# Altium schematic sheet InputOutput.SchDoc
size 279 x 177 mm; SheetNumber: 5; SheetTotal: 5
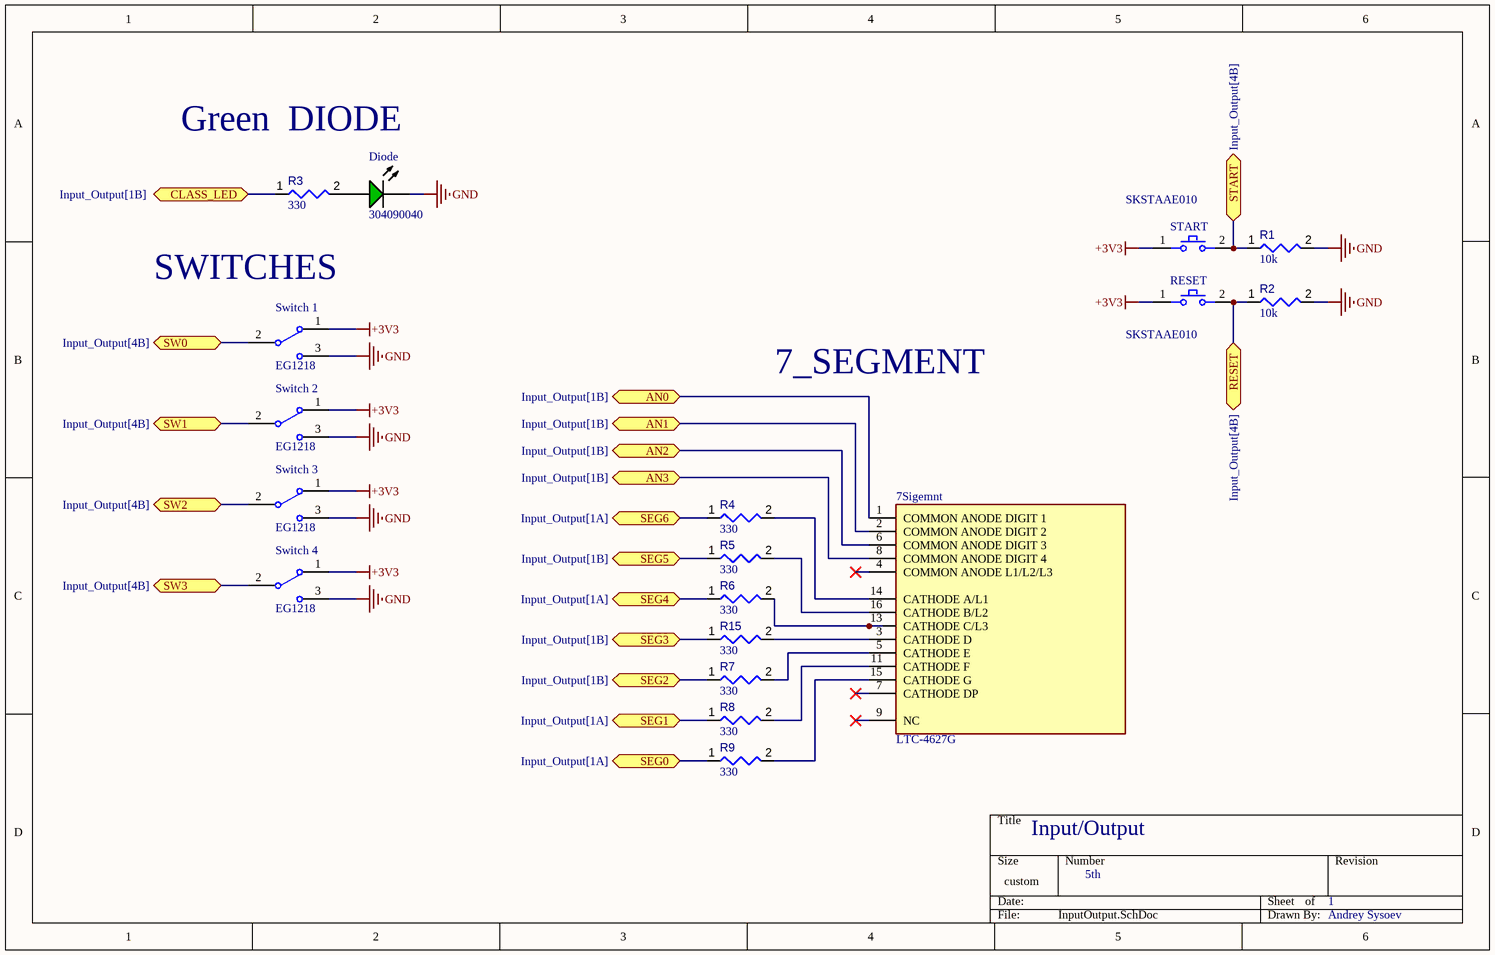
[diagram p0: InputOutput.SchDoc]

## Parts
7Sigemnt  LTC-4627G  [FP-LTC-4627G-MFG]
Diode  304090040  [LED-2P-2.28-3MM]
R1  value 10k  [RESC0402(1005)_L]  (hidden comment: 10KR2F)
R2  value 10k  [RESC0402(1005)_L]  (hidden comment: 10KR2F)
R3  value 330  [RESC0402(1005)_L]  (hidden comment: 330R2J)
R4  value 330  [RESC0402(1005)_L]  (hidden comment: 330R2J)
R5  value 330  [RESC0402(1005)_L]  (hidden comment: 330R2J)
R6  value 330  [RESC0402(1005)_L]  (hidden comment: 330R2J)
R7  value 330  [RESC0402(1005)_L]  (hidden comment: 330R2J)
R8  value 330  [RESC0402(1005)_L]  (hidden comment: 330R2J)
R9  value 330  [RESC0402(1005)_L]  (hidden comment: 330R2J)
R15  value 330  [RESC0402(1005)_L]  (hidden comment: 330R2J)
RESET  SKSTAAE010  [FP-SKSTAAE010-MFG]
START  SKSTAAE010  [FP-SKSTAAE010-MFG]
Switch_1  EG1218  [ESWI-EG1218_V]
Switch_2  EG1218  [ESWI-EG1218_V]
Switch_3  EG1218  [ESWI-EG1218_V]
Switch_4  EG1218  [ESWI-EG1218_V]

## Ports
AN0 (bidir, see Input_Output[1B]), AN1 (bidir, see Input_Output[1B]), AN2 (bidir, see Input_Output[1B]), AN3 (bidir, see Input_Output[1B]), CLASS_LED (bidir, see Input_Output[1B]), RESET (bidir, see Input_Output[4B]), SEG0 (bidir, see Input_Output[1A]), SEG1 (bidir, see Input_Output[1A]), SEG2 (bidir, see Input_Output[1B]), SEG3 (bidir, see Input_Output[1B]), SEG4 (bidir, see Input_Output[1A]), SEG5 (bidir, see Input_Output[1B]), SEG6 (bidir, see Input_Output[1A]), START (bidir, see Input_Output[4B]), SW0 (bidir, see Input_Output[4B]), SW1 (bidir, see Input_Output[4B]), SW2 (bidir, see Input_Output[4B]), SW3 (bidir, see Input_Output[4B])

## Nets
+3V3: RESET.1 START.1 Switch_1.1 Switch_2.1 Switch_3.1 Switch_4.1
GND: Diode.2(K) R1.2 R2.2 Switch_1.3 Switch_2.3 Switch_3.3 Switch_4.3
AN0: 7Sigemnt.1(COMMON_ANODE_DIGIT_1) ; port AN0
AN1: 7Sigemnt.2(COMMON_ANODE_DIGIT_2) ; port AN1
AN2: 7Sigemnt.6(COMMON_ANODE_DIGIT_3) ; port AN2
AN3: 7Sigemnt.8(COMMON_ANODE_DIGIT_4) ; port AN3
CLASS_LED: R3.1 ; port CLASS_LED
RESET: R2.1 RESET.2 ; port RESET
SEG0: R9.1 ; port SEG0
SEG1: R8.1 ; port SEG1
SEG2: R7.1 ; port SEG2
SEG3: R15.1 ; port SEG3
SEG4: R6.1 ; port SEG4
SEG5: R5.1 ; port SEG5
SEG6: R4.1 ; port SEG6
START: R1.1 START.2 ; port START
SW0: Switch_1.2(COM) ; port SW0
SW1: Switch_2.2(COM) ; port SW1
SW2: Switch_3.2(COM) ; port SW2
SW3: Switch_4.2(COM) ; port SW3
Net7Sigemnt_3: 7Sigemnt.3(CATHODE_D) R15.2
Net7Sigemnt_5: 7Sigemnt.5(CATHODE_E) R7.2
Net7Sigemnt_11: 7Sigemnt.11(CATHODE_F) R8.2
Net7Sigemnt_13: 7Sigemnt.13(CATHODE_C/L3) R6.2
Net7Sigemnt_14: 7Sigemnt.14(CATHODE_A/L1) R4.2
Net7Sigemnt_15: 7Sigemnt.15(CATHODE_G) R9.2
Net7Sigemnt_16: 7Sigemnt.16(CATHODE_B/L2) R5.2
NetDiode_1: Diode.1(A) R3.2

Not connected (* = marked no-connect by the designer): 7Sigemnt 4(COMMON_ANODE_L1/L2/L3)* 7(CATHODE_DP)* 9(NC)*

## Notes on the sheet
- Green  DIODE
- SWITCHES
- 7_SEGMENT
- Input/Output
- 5th
- 1
- Andrey Sysoev

## Library data of the parts
7Sigemnt = CMP-031-00011-1: 7 Seg Numeric LED Display, 4-Character, Green, 10mm; Max Operating Temperature: 85°C; Mounting Technology: Through Hole; Case/Package: PDIP; Min Operating Temperature: -35°C; Pins: 14
Diode = CMP-007-00006-2: Green LED, 80 mW, 20 mA, -25 to 85 degC, 2-Pin THD; Manufacturer: Shenzhen CGX; Manufacturer URL: http://szcgx.com/; Package Reference: 304090040; Datasheet Version: Rev. 1.0, 09/2014; RoHS Compliant: Unknown; Case/Package: 304090040; Package Description: 2-Pin Through Hole Device, Dia 3 mm, Pitch 2.28 mm; Datasheet URL: http://datasheet.octopart.com/304090040-Chengguangxing-datasheet-62330655.pdf; Mounting Technology: TH
R1 R2 = CMP-009-00066-2: 10K 0.063W 1% 0402 (1005 Metric)  SMD; Power: 63mW; Case/Package: 0402; Mounting Technology: SMT; Pins: 2; Tolerance: 1%
R3-R9 R15 = CMP-009-00095-2: 330R 0.063W 5% 0402 (1005 Metric)  SMD; Power: 63mW; Tolerance: 5%; Mounting Technology: SMT; Case/Package: 0402; Pins: 2
RESET START = CMP-031-00010-1: Switch Tactile N.O. SPST Round Button J-Bend 0.05A 16VDC 500000Cycles 4N SMD T/R; Max Operating Temperature: 90°C; Min Operating Temperature: -40°C; Mounting Technology: Surface Mount
Switch_1-Switch_4 = CMP-011-00006-2: Slide Switch, SPDT, 500 V, -20 to 70 degC, 3-Pin THD, RoHS, Bulk; Manufacturer: E-Switch; Voltage Rating (DC): 30V; Current Rating: 200mA; Operating Force: 250gf; Package Quantity: 1000; Contact Plating: Silver; Max Operating Temperature: 70°C; Min Operating Temperature: -20°C; Contact Material: Copper; Datasheet URL: https://www.e-switch.com/system/asset/product_line/data_sheet/119/EG.pdf; Contact Finish: Silver; Case/Package: EG1218; Voltage Rating (AC): 30V; Datasheet Version: Oct-15; Package Description: 3-Pin Through Hole Device, Body 11.6 x 4 mm, Pitch 2.5 mm; RoHS Compliant: True; Package Reference: EG1218; Manufacturer URL: http://www.e-switch.ch/en/; Throw Configuration: SPDT; Contact Current Rating: 200mA; Mounting Technology: TH; Packaging: Bulk; Pins: 3